# Altium schematic sheet PC110.SchDoc
size 297 x 209 mm
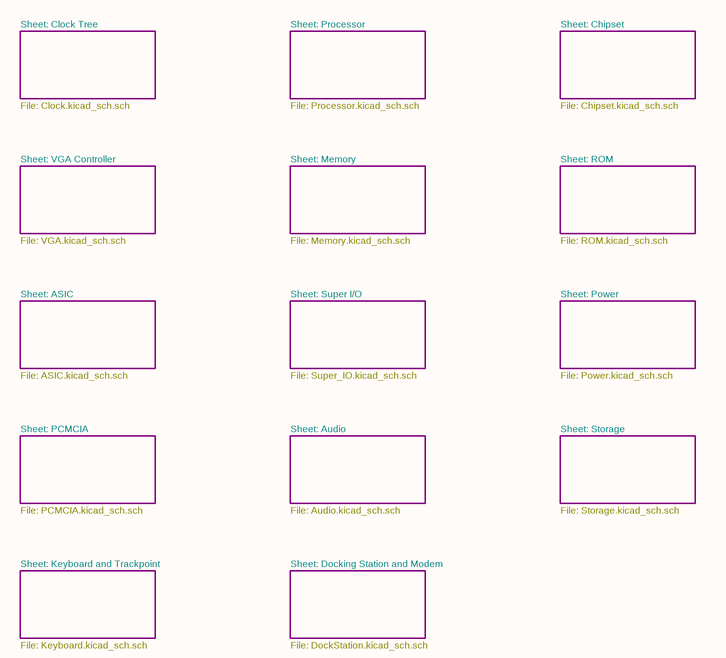
[diagram p0: PC110.SchDoc]

## Sub-sheets
ASIC = ASIC.SchDoc: no entries
Audio = Audio.SchDoc: no entries
Chipset = Chipset.SchDoc: no entries
Clock Tree = Clock.SchDoc: no entries
Docking Station and Modem = DockStation.SchDoc: no entries
Keyboard and Trackpoint = Keyboard.SchDoc: no entries
Memory = Memory.SchDoc: no entries
PCMCIA = PCMCIA.SchDoc: no entries
Power = Power.SchDoc: no entries
Processor = Processor.SchDoc: no entries
ROM = ROM.SchDoc: no entries
Storage = Storage.SchDoc: no entries
Super I/O = Super_IO.SchDoc: no entries
VGA Controller = VGA.SchDoc: no entries

## Notes on the sheet
- Sheet: Clock Tree
- Sheet: Processor
- Sheet: Chipset
- File: Clock.kicad_sch.sch
- File: Processor.kicad_sch.sch
- File: Chipset.kicad_sch.sch
- Sheet: VGA Controller
- Sheet: Memory
- Sheet: ROM
- File: VGA.kicad_sch.sch
- File: Memory.kicad_sch.sch
- File: ROM.kicad_sch.sch
- Sheet: ASIC
- Sheet: Super I/O
- Sheet: Power
- File: ASIC.kicad_sch.sch
- File: Super_IO.kicad_sch.sch
- File: Power.kicad_sch.sch
- Sheet: PCMCIA
- Sheet: Audio
- Sheet: Storage
- File: PCMCIA.kicad_sch.sch
- File: Audio.kicad_sch.sch
- File: Storage.kicad_sch.sch
- Sheet: Keyboard and Trackpoint
- Sheet: Docking Station and Modem
- File: Keyboard.kicad_sch.sch
- File: DockStation.kicad_sch.sch
- 1
- 2
- 3
- 4
- 5
- 6
- A
- B
- C
- D
- Title: PC110 Motherboard
- File: PC110.kicad_sch
- Sheet: /
- Recreated by: Ahmad Byagowi
- KiCad E.D.A.  kicad (5.1.4)-1
- Size: A4
- Date:
- Rev:
- Id: 1/1